# EAGLE design esp32 gps pcb (EAGLE 9.6.2)
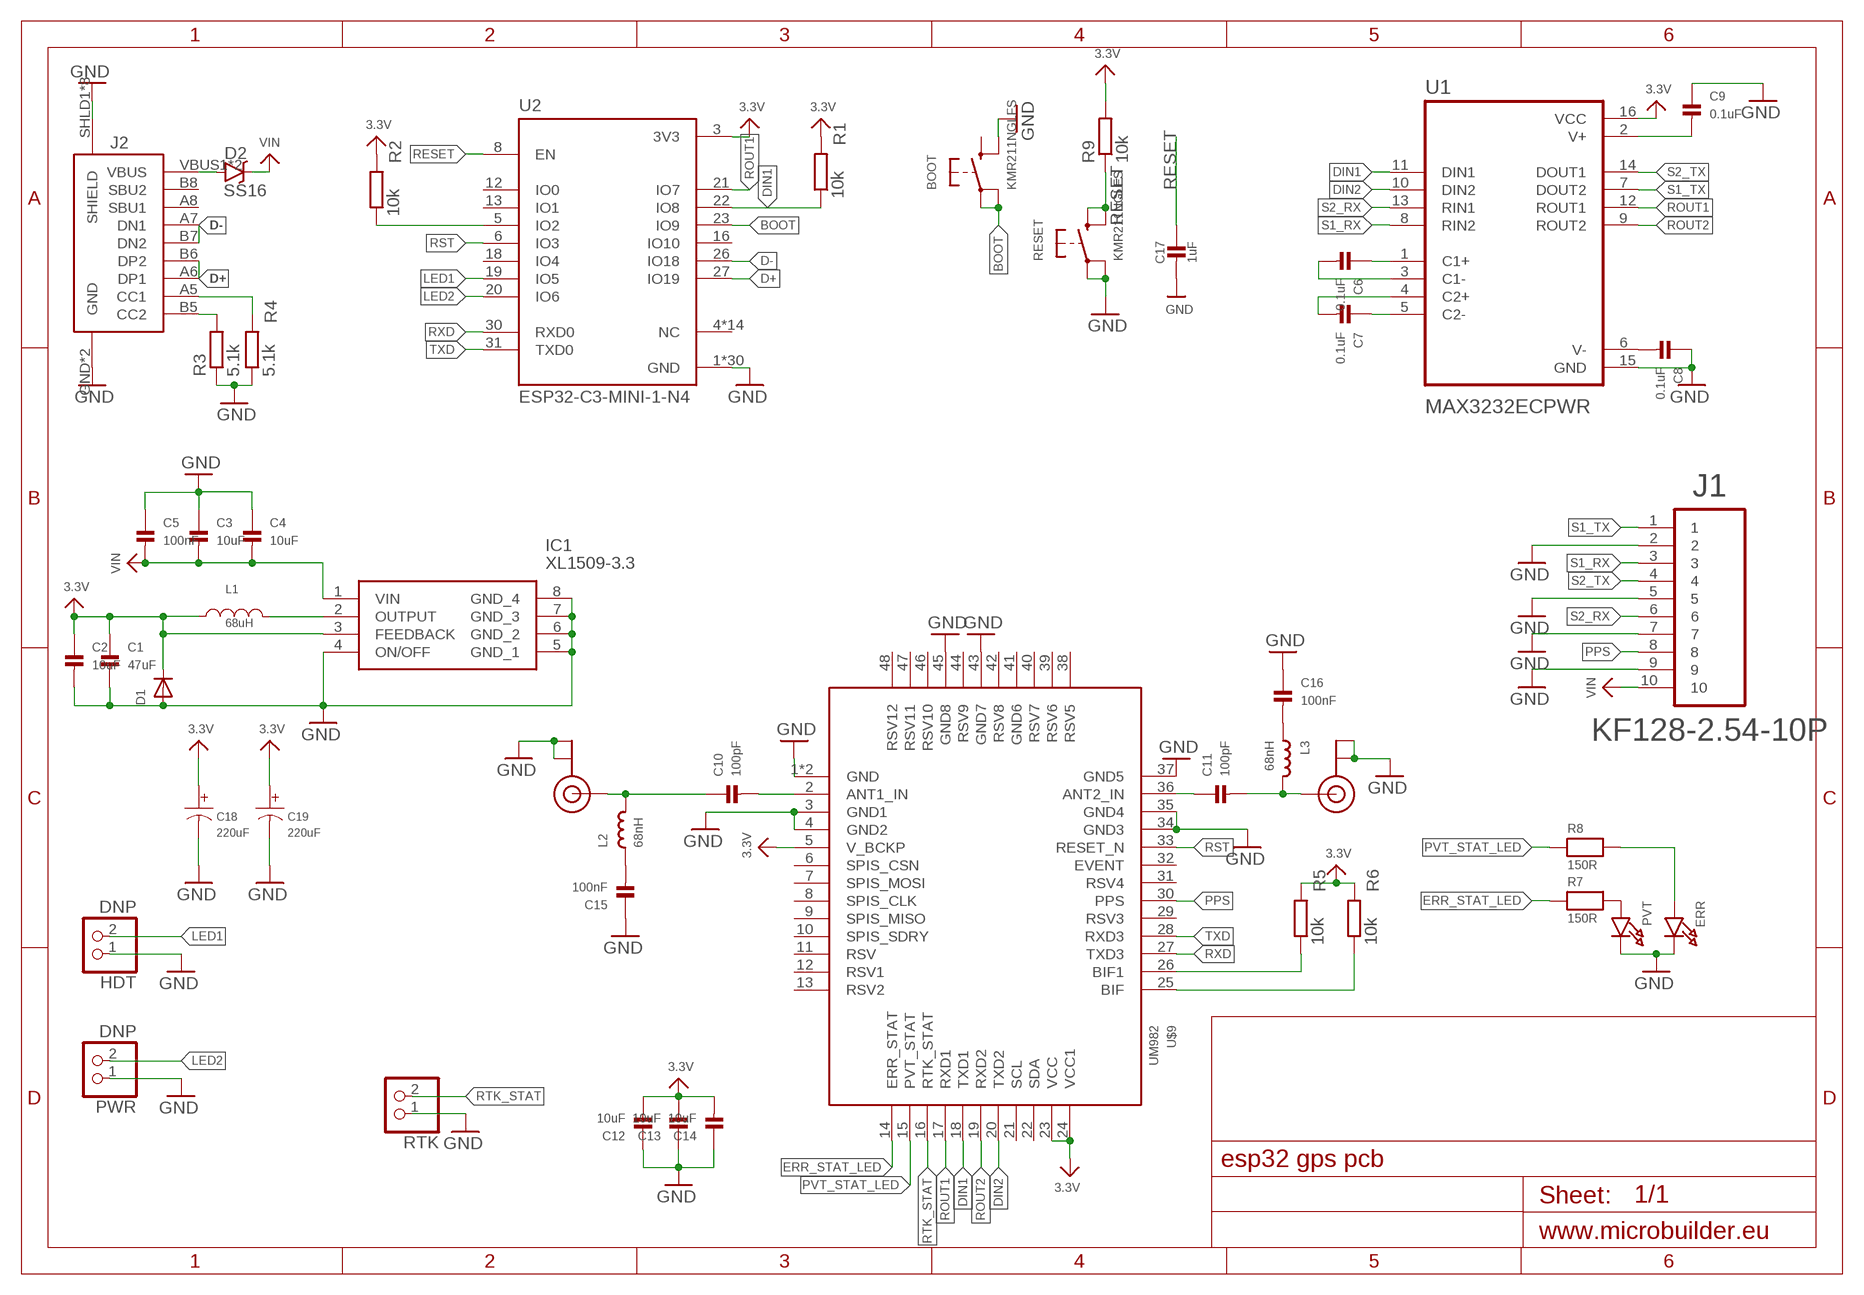
[diagram p0: schematic, sheet 1]

## Parts
BOOT  KMR211NGLFS  SWITCH_TACT_SMT4.6X2.8  [BTN_KMR2_4.6X2.8]
C1  47uF  CAP_CERAMIC_0805  [_0805]
C2  10uF  CAP_CERAMIC_0603  [_0603]
C3  10uF  CAP_CERAMIC_0603  [_0603]
C4  10uF  CAP_CERAMIC_0603  [_0603]
C5  100nF  CAP_CERAMIC_0603  [_0603]
C6  0.1uF  CAP_CERAMIC_0603  [_0603]
C7  0.1uF  CAP_CERAMIC_0603  [_0603]
C8  0.1uF  CAP_CERAMIC_0603  [_0603]
C9  0.1uF  CAP_CERAMIC_0603  [_0603]
C10  100pF  CAP_CERAMIC_0603  [_0603]
C11  100pF  CAP_CERAMIC_0603  [_0603]
C12  10uF  CAP_CERAMIC_0603  [_0603]
C13  10uF  CAP_CERAMIC_0603  [_0603]
C14  10uF  CAP_CERAMIC_0603  [_0603]
C15  100nF  CAP_CERAMIC_0603  [_0603]
C16  100nF  CAP_CERAMIC_0603  [_0603]
C17  1uF  CAP_CERAMIC_0603  [_0603]
C18  220uF  220UF220UF_CAP-SMD_BD6.3-L6.6-W6.6-FD  [CAP-SMD_BD6.3-L6.6-W6.6-FD]
C19  220uF  220UF220UF_CAP-SMD_BD6.3-L6.6-W6.6-FD  [CAP-SMD_BD6.3-L6.6-W6.6-FD]
D1  DIODESMA  [SMADIODE]
D2  SS16  DIODE-SCHOTTKY-B340A  [SMA-DIODE]
ERR  LED0603  [CHIPLED_0603]
HDT  DNP  HEADER-1X2ROUND  [1X02_ROUND]
IC1  XL1509-3.3  [SOIC127P600X175-8N]
J1  KF128-2.54-10P  [KF128-2.54-10P]
J2  TYP-C16PIN2MD  [USB-C-16P]
L1  68uH  PNLS6045_680  [IND-SMD_L6.0-W6.0]
L2  68nH  INDUCTOR_0603  [_0603]
L3  68nH  INDUCTOR_0603  [_0603]
PRI  KH-IPEX-K501-29  U.FL  [U.FL]
PVT  LED0603  [CHIPLED_0603]
PWR  DNP  HEADER-1X2ROUND  [1X02_ROUND]
R1  10k  R-EU_R0402  [R0402]
R2  10k  R-EU_R0402  [R0402]
R3  5.1k  R-EU_R0402  [R0402]
R4  5.1k  R-EU_R0402  [R0402]
R5  10k  R-EU_R0402  [R0402]
R6  10k  R-EU_R0402  [R0402]
R7  150R  RESISTOR_0603  [_0603]
R8  150R  RESISTOR_0603  [_0603]
R9  10k  R-EU_R0603  [R0603]
RESET  KMR211NGLFS  SWITCH_TACT_SMT4.6X2.8  [BTN_KMR2_4.6X2.8]
RTK  HEADER-1X2ROUND  [1X02_ROUND]
SEC  KH-IPEX-K501-29  U.FL  [U.FL]
U1  MAX3232ECPWR  [SOP65P640X120-16N]
U2  ESP32-C3-MINI-1-N4  [XCVR_ESP32-C3-MINI-1-N4]
U$9  UM982  [UM982]

## Nets
3.3V: C1.1 C2.1 C12.2 C13.2 C14.2 C18.1 C19.1 D1.C IC1.3(FEEDBACK) L1.1 R1.2 R2.2 R5.2 R6.2 R9.2 U1.16(VCC) U2.3(3V3) U$9.5(V_BCKP) U$9.23(VCC) U$9.24(VCC1)
BOOT: BOOT.A'(P1) BOOT.A(P) U2.23(IO9)
D+: J2.A6(DP1) J2.B6(DP2) U2.27(IO19)
D-: J2.A7(DN1) J2.B7(DN2) U2.26(IO18)
DIN1: R1.1 U1.11(DIN1) U2.22(IO8) U$9.18(TXD1)
DIN2: U1.10(DIN2) U$9.20(TXD2)
ERR_STAT_LED: R7.1 U$9.14(ERR_STAT)
GND: BOOT.B'(S1) C1.2 C2.2 C3.1 C4.1 C5.1 C8.1 C9.1 C12.1 C13.1 C14.1 C15.1 C16.1 C17.2 C18.2 C19.2 D1.A ERR.C HDT.1 IC1.4(ON/OFF) IC1.5(GND_1) IC1.6(GND_2) IC1.7(GND_3) IC1.8(GND_4) J1.2 J1.5 J1.7 J1.9 J2.GND J2.GND2(GND) J2.SHLD1(SHIELD) J2.SHLD2(SHIELD) J2.SHLD3(SHIELD) J2.SHLD4(SHIELD) J2.SHLD5(SHIELD) J2.SHLD6(SHIELD) J2.SHLD7(SHIELD) J2.SHLD8(SHIELD) PRI.1(GND) PRI.2(GND) PVT.C PWR.1 R3.1 R4.1 RESET.A'(P1) RESET.A(P) RTK.1 SEC.1(GND) SEC.2(GND) U1.15(GND) U2.1(GND) U2.2(GND) U2.11(GND) U2.14(GND) U2.36(GND) U2.37(GND) U2.38(GND) U2.39(GND) U2.40(GND) U2.41(GND) U2.42(GND) U2.43(GND) U2.44(GND) U2.45(GND) U2.46(GND) U2.47(GND) U2.48(GND) U2.49_1(GND) U2.49_2(GND) U2.49_3(GND) U2.49_4(GND) U2.49_5(GND) U2.49_6(GND) U2.49_7(GND) U2.49_8(GND) U2.49_9(GND) U2.50(GND) U2.51(GND) U2.52(GND) U2.53(GND) U$9.1(GND) U$9.3(GND1) U$9.4(GND2) U$9.34(GND3) U$9.35(GND4) U$9.37(GND5) U$9.43(GND7) U$9.45(GND8) U$9.P$1(GND)
LED1: HDT.2 U2.19(IO5)
LED2: PWR.2 U2.20(IO6)
N$1: C6.1 U1.1(C1+)
N$2: C8.2 U1.6(V-)
N$3: C10.1 L2.2 PRI.3(SIGNAL)
N$4: C6.2 U1.3(C1-)
N$5: C9.2 U1.2(V+)
N$6: C10.2 U$9.2(ANT1_IN)
N$7: C7.1 U1.5(C2-)
N$8: C7.2 U1.4(C2+)
N$9: C11.1 U$9.36(ANT2_IN)
N$10: R5.1 U$9.26(BIF1)
N$11: J2.B5(CC2) R3.2
N$12: J2.A5(CC1) R4.2
N$13: D2.A J2.VBUS1(VBUS) J2.VBUS2(VBUS)
N$14: IC1.2(OUTPUT) L1.2
N$15: R2.1 U2.5(IO2)
N$16: R6.1 U$9.25(BIF)
N$26: C11.2 L3.2 SEC.3(SIGNAL)
N$27: C15.2 L2.1
N$29: PVT.A R7.2
N$30: C16.2 L3.1
N$31: ERR.A R8.2
PPS: J1.8 U$9.30(PPS)
PVT_STAT_LED: R8.1 U$9.15(PVT_STAT)
RESET: C17.1 R9.1 RESET.B'(S1) RESET.B(S) U2.8(EN)
ROUT1: U1.12(ROUT1) U2.21(IO7) U$9.17(RXD1)
ROUT2: U1.9(ROUT2) U$9.19(RXD2)
RST: U2.6(IO3) U$9.33(RESET_N)
RTK_STAT: RTK.2 U$9.16(RTK_STAT)
RXD: U2.30(RXD0) U$9.27(TXD3)
S1_RX: J1.3 U1.8(RIN2)
S1_TX: J1.1 U1.7(DOUT2)
S2_RX: J1.6 U1.13(RIN1)
S2_TX: J1.4 U1.14(DOUT1)
TXD: U2.31(TXD0) U$9.28(RXD3)
VIN: C3.2 C4.2 C5.2 D2.C IC1.1(VIN) J1.10
Unconnected: BOOT.B(S) J2.A8(SBU1) J2.B8(SBU2) U2.4(NC) U2.7(NC) U2.9(NC) U2.10(NC) U2.12(IO0) U2.13(IO1) U2.15(NC) U2.16(IO10) U2.17(NC) U2.18(IO4) U2.24(NC) U2.25(NC) U2.28(NC) U2.29(NC) U2.32(NC) U2.33(NC) U2.34(NC) U2.35(NC) U$9.6(SPIS_CSN) U$9.7(SPIS_MOSI) U$9.8(SPIS_CLK) U$9.9(SPIS_MISO) U$9.10(SPIS_SDRY) U$9.11(RSV) U$9.12(RSV1) U$9.13(RSV2) U$9.21(SCL) U$9.22(SDA) U$9.29(RSV3) U$9.31(RSV4) U$9.32(EVENT) U$9.38(RSV5) U$9.39(RSV6) U$9.40(RSV7) U$9.41(GND6) U$9.42(RSV8) U$9.44(RSV9) U$9.46(RSV10) U$9.47(RSV11) U$9.48(RSV12)

## Library data of the parts
BOOT RESET = adafruit_electromech:SWITCH_TACT_SMT: SMT Tact Switches 6x6mm - Digikey: P12940SCT-ND KMR2 (4.6x2.8mm) - Digikey: 401-1426-1-ND EVQ-PQHB55 - Light Touch, 160GF (4.5x4.5mm) - Digikey: P8090SCT-ND KMT0 - KMT021 NGJ LHS (etc.) IP68/Waterproof - Digikey: CKN10289CT-ND
C1-C9 C11-C14 C17 = microbuilder:CAP_CERAMIC: Ceramic Capacitors 0402 - 0402 Surface Mount Capacitors 16pF 50V 5% [Digikey: 445-4899-2-ND] 18pF 50V 5% [Digikey: 490-1281-2-ND] 22pF 50V 5% [Digikey: 490-1283-2-ND] 68pF 50V 5% [Digikey: 490-1289-2-ND] 0.1uF 10V 10% [Digikey: 490-1318-2-ND] 1.0uF 6.3V 10% [Digikey: 490-1320-2-ND] 0603 - 0603 Surface Mount Capacitors 16 pF 50V 5% [Digikey: 445-5051-2-ND] 22 pF 50V [Digikey: PCC220ACVTR-ND] 33 pF 50V 5% [Digikey: 490-1415-1-ND] 56pF 50V 5% [Digikey: 490-1421-1-ND] 220pF 50V 5% [Digikey: 445-1285-1-ND] 680 pF 50V 2200 pF 50V 5% C0G [Digikey: 445-1297-1-ND] 5600 pF 100V 5% X7R [Digikey: 478-3711-1-ND] 0.1 µF 25V 10% [Digikey: PCC2277TR-ND] 0.22 µF 16V 10% X7R [Digikey: 445-1318-1-ND] 1.0 µF 25V 10% [Digikey: 445-5146-2-ND] 0603 - RF Specific 3pF 250V +/-0.1pF RF [Digikey: 712-1347-1-ND] 18 pF 250V 5% [Digikey: 478-3505-1-ND or 712-1322-1-ND] 56 pF 250V 5% C0G RF [Digikey: 490-4867-1-ND] 68 pF 250V RF [Digikey: 490-4868-1-ND] 0805 - 0805 Surface Mount Capacitors 220 pF 250V 2% RF Ceramic Capacitor [Digikey: 712-1398-1-ND] 1000 pF 50V 2% NP0 Ceramic Capacitor [Digikey: 478-3760-1-ND] 0.1 µF 25V 10% Ceramic Capacitor [Digikey: PCC1828TR-ND] 1.0 µF 16V 10% Ceramic Capacitor[Digikey: 490-1691-2-ND] 10.0 µF 10V 10% Ceramic Capacitor[Digikey: 709-1228-1-ND] 10.0 uF 16V 10% Ceramic Capacitor [Digikey: 478-5165-2-ND] 47 uF 6.3V 20% Ceramic Capacitor [Digikey: 587-1779-1-ND or 399-5506-1-ND] 1206 - 1206 Surface Mount Capacitors 47uF 10V 20% Ceramic Capacitor [Digikey: 490-5528-1-ND or 399-5508-1-ND or 445-6010-1-ND] 100uF 6.3V -20%, +80% Y5V Ceramic Capacitor (Digikey: 490-4512-1-ND, Mouser: 81-GRM31CF50J107ZE1L)
C10 C15 C16 = microbuilder:CAP_CERAMIC: Ceramic Capacitors 0402 - 0402 Surface Mount Capacitors 16pF 50V 5% [Digikey: 445-4899-2-ND] 18pF 50V 5% [Digikey: 490-1281-2-ND] 22pF 50V 5% [Digikey: 490-1283-2-ND] 68pF 50V 5% [Digikey: 490-1289-2-ND] 0.1uF 10V 10% [Digikey: 490-1318-2-ND] 1.0uF 6.3V 10% [Digikey: 490-1320-2-ND] 0603 - 0603 Surface Mount Capacitors 16 pF 50V 5% [Digikey: 445-5051-2-ND] 22 pF 50V [Digikey: PCC220ACVTR-ND] 33 pF 50V 5% [Digikey: 490-1415-1-ND] 56pF 50V 5% [Digikey: 490-1421-1-ND] 220pF 50V 5% [Digikey: 445-1285-1-ND] 680 pF 50V 2200 pF 50V 5% C0G [Digikey: 445-1297-1-ND] 5600 pF 100V 5% X7R [Digikey: 478-3711-1-ND] 0.1 µF 25V 10% [Digikey: PCC2277TR-ND] 0.22 µF 16V 10% X7R [Digikey: 445-1318-1-ND] 1.0 µF 25V 10% [Digikey: 445-5146-2-ND] 0603 - RF Specific 3pF 250V +/-0.1pF RF [Digikey: 712-1347-1-ND] 18 pF 250V 5% [Digikey: 478-3505-1-ND or 712-1322-1-ND] 56 pF 250V 5% C0G RF [Digikey: 490-4867-1-ND] 68 pF 250V RF [Digikey: 490-4868-1-ND] 0805 - 0805 Surface Mount Capacitors 220 pF 250V 2% RF Ceramic Capacitor [Digikey: 712-1398-1-ND] 1000 pF 50V 2% NP0 Ceramic Capacitor [Digikey: 478-3760-1-ND] 0.1 µF 25V 10% Ceramic Capacitor [Digikey: PCC1828TR-ND] 1.0 µF 16V 10% Ceramic Capacitor[Digikey: 490-1691-2-ND] 10.0 µF 10V 10% Ceramic Capacitor[Digikey: 709-1228-1-ND] 10.0 uF 16V 10% Ceramic Capacitor [Digikey: 478-5165-2-ND] 47 uF 6.3V 20% Ceramic Capacitor [Digikey: 587-1779-1-ND or 399-5506-1-ND] 1206 - 1206 Surface Mount Capacitors 47uF 10V 20% Ceramic Capacitor [Digikey: 490-5528-1-ND or 399-5508-1-ND or 445-6010-1-ND] 100uF 6.3V -20%, +80% Y5V Ceramic Capacitor (Digikey: 490-4512-1-ND, Mouser: 81-GRM31CF50J107ZE1L); SPICEPREFIX: C
C18 C19 = RVT1A221M0605:220UF: No description set; BOM_JLCPCB_PART_CLASS: Extended Part; BOM_MANUFACTURER: ROQANG(??); BOM_MANUFACTURER_PART: RVT1A221M0605; BOM_SUPPLIER: LCSC; BOM_SUPPLIER_PART: C72494; NAMEALIAS: Capacitance; SPICEPRE: C; SPICESYMBOLNAME: RVT1A221M0605-C72494
D1 = microbuilder:DIODE: Diode SMA Model Volts Amps Type Vf Vr Digikey # Notes SSA34-E3 40V 3A Schottky 480mV @ 3A 200uA @ 40V SSA34-E3/61TGITR-ND CDBA120-G 20V 1A Schottky 500mV @ 1A 500uA @ 20V 641-1014-6-ND REEL MBRA210 10V 2A Schottky 350mV @ 2A 700uA @ 10V MBRA210LT3 SOD-123 Model Volts Amps Type Vf Vr Order # Notes BAT54T1G 30V 200mA Schottky 800mV @ 200mA 2uA @ 25V BAT54T1GOSTR-ND B0530W 30V 500mA Schottky 430mV @ 500mA 130uA @ 30V B0530W-FDICT-ND REEL MBR120 1A 20V Schottky 340mV @ 1A MBR120VLSFT1GOSCT-ND SOD-323 Model Volts Amps Type Vf Vr Order # Notes PMEG2005EJ 20V 500mA Schottky 355mV @ 500mA 568-4110-1-ND ZLLS410 10V 570mA Schottky 380mV @ 570mA ZLLS410CT-ND 1N4148WS 75V 150mA Silicon/Simple 1V 1N4148WSFSCT-ND REEL SOD-523 Model Volts Amps Type Vf Vr Order # Notes BAT54XV2 30V 200mA Schottky 0.8V @ 100mA BAT54XV2CT-ND TB751S 30V 30mA Schottky RB751S-40TE61CT-ND SOT23-R/W (R = Solder Paste/Reflow Ovens, W = Hand-Soldering) Model Volts Amps Type Vf Vr Order # Notes BAT54FILM 40V 300mA Schottky 497-7162-1-ND
D2 = SparkFun-DiscreteSemi:DIODE-SCHOTTKY: Schottky diodes in SFE's production catalog BAT20J 1A 23V 0.62Vf RB751 120mA 40V 0.37Vf PMEG4005EJ 0.5A 40V 0.42Vf MBRA140 1A 40V 0.5Vf B340A 3A 40V SMA; PROD_ID: DIO-09886; VALUE: B340A
ERR PVT = microbuilder:LED: LED 0603 - 0603 Surface Mount Package 2mA: Green LED - Low Power (3.9mcd, 2ma, 1.7Vf) - Digikey: 475-2709-2-ND Orange LED - Low Power (9.8mcd, 2ma, 1.8Vf) - Digikey: 475-1194-2-ND Red LED - Low Power (5mcd, 2ma, 1.8Vf) - Digikey: 475-1195-2-ND Yellow LED - Low Power (7mcd, 2ma, 1.8Vf) - Digikey: 475-1196-2-ND 5mA: Blue LED - Low Power (17mcd, 5ma, 2.9Vf) - Digikey: LNJ937W8CRACT-ND 0805 - 0805 Surface Mount Package 2mA: Red LED (8.8mcd, 2mA, 1.8Vf, Clear) - Low Power [Digikey: 475-2510-1-ND] Green LED (5mcd, 2mA, 1.8Vf, Clear) - Low Power [Digikey: 475-2730-1-ND] Yellow LED (11.3mcd, 2mA, 1.8Vf, Clear) - Low Power [Digikey: 475-2555-1-ND] 20mA: Red LED (104mcd, 20mA, Diffused) - LS R976 [Digikey: 475-1278-6-ND] Red LED (12mcd, 20mA, 2.0Vf, Clear) - APT2012EC [Digikey: 754-1128-1-ND] Green LED (15mcd, 20mA, 2.2Vf, Clear) - APT2012GC [Digikey: 754-1131-1-ND] Orange LED (160mcd, 20mA, 2.1Vf, Clear) - APT2012SECK [Digikey: 754-1130-1-ND] 1206 - 1206 Surface Mount Package Green LED (26mcd, 20mA, Diffused) - LG N971 [Digikey: 475-1407-6-ND] Red LED (15mcd, 20mA, Diffused) - LH N974 [Digikey: 475-1416-6-ND]
HDT PWR RTK = microbuilder:HEADER-1X2: PIN HEADER
IC1 = XL1509-3.3:XL1509-3.3: gh Source: Datasheet <https://datasheet.lcsc.com/lcsc/1809050422_XLSEMI-XL1509-5-0E1_C61063.pdf>; DESCRIPTION: gh; HEIGHT: 1.75mm; MANUFACTURER_NAME: 1-Avel; MANUFACTURER_PART_NUMBER: XL1509-3.3
J1 = KF128-2.54-10P:KF128-2.54-10P: TERM BLOCK 10POS SIDE ENT 2.54MM; COMMENT: 1-282834-0; DESCRIPTION: Conn Eurostyle Block 10 POS 2.54mm Solder ST Thru-Hole 10A/Contact Box; DIGI-KEY_PART_NUMBER: A98074-ND; EU_ROHS_COMPLIANCE: Compliant with Exemptions; MF: TE Connectivity; MP: 1-282834-0; PACKAGE: None; PURCHASE-URL: https://pricing.snapeda.com/search/part/1-282834-0/?ref=eda
J2 = TYPE-C 16PIN 2MD:TYP-C16PIN2MD: Check availability <https://pricing.snapeda.com/parts/TYPE-C-31-M-12/HRO%20Electronics%20Co.%2C%20Ltd./view-part?ref=eda>
L1 = PNLS6045:PNLS6045_680
L2 L3 = microbuilder:INDUCTOR: Inductors 0603: 10nH Ceramic Inductor - microwire antenna/RF (Digikey: 712-1434-2-ND) 0805: 560nH Ceramic Inductor - RF (Digikey: 553-1047-1-ND) 270nH Ceramic Inductor - Q = 40@250MHz, +-5%, 1 Ohm DC Resistance (Digikey: 535-10506-2-ND) 1007 (2518 Metric) SMT: 10µH 10% 250mOhm 820mA 1007 Inductor (Digikey: 587-2189-1-ND) 22µH 10% 500mOhm 580mA 1007 Inductor (Digikey: 587-2190-1-ND) 47µH 10% 950mOhm 420mA 1007 Inductor (Digikey: 587-2191-1-ND) 47µH 5% 100mOhm 1A 1008 Inductor (Digikey: 732-1816-1-ND) 5.0x5.0mm (Taiyo Yuden NR5040 Series) 6.8µH 20% 2.3A 64mOhm Inductor (Digikey: 587-2374-2-ND) 5.0x5.0mm (TDK VLC5045 Series) 4.7µH 20% 3.3A 34mOhm Inductor (Digikey: 445-6526-1-ND) 6.8µH 20% 2.7A 46mOhm Inductor (Digikey: 445-6527-1-ND) 6.0x6.0mm (TDK VLC6045 Series) 4.7µH 20% 3.8A 27mOhm Inductor (Digikey: 445-6538-2-ND) 6.8µH 20% 3A 41mOhm Inductor (Digikey: 445-6540-1-ND) 6.2µH 30% 2.2A 45mOhm Inductor (Digikey: SRR5028-6R2YCT-ND) - Not TDK VLC6045 but footprint should match 6.0x6.0mm (TDK SLF6045 Series) 6.8uH 30% 2A 33mOhm Inductor (Digikey: 445-4572-1-ND, Mouser: 810-SLF645T6R8N2R0PF)
PRI SEC = microbuilder:U.FL: U.FL Antenna Connector
R1-R6 R9 = rcl:R-EU_: RESISTOR, European symbol; SPICEPREFIX: R
R7 R8 = microbuilder:RESISTOR: Resistors 0402 - 0402 Surface Mount Package 22 Ohm 1% 1/16W [Digikey: 311-22.0LRTR-ND] 33 Ohm 5% 1/16W 1.0K 5% 1/16W 1.5K 5% 1/16W 2.0K 1% 1/16W 10.0K 1% 1/16W [Digikey: 311-10.0KLRTR-ND] 10.0K 5% 1/16W [Digikey: RMCF0402JT10K0TR-ND] 12.1K 1% 1/16W [Digikey: 311-22.0LRTR-ND] 100.0K 5% 1/16W 0603 - 0603 Surface Mount Package 0 Ohm 1/10 Watt 1% Resistor 15 Ohm 1/10 Watt 1% Resistor 33 Ohm 1/10 Watt 1% Resistor 49.9 Ohm 1/10 Watt 1% Resistor 100 Ohm 1/10 Watt 1% Resistor 150 Ohm 1/10 Watt 1% Resistor 240 Ohm 1/10 Watt 1% Resistor 390 Ohm 1/10 Watt 1% Resistor 560 Ohm 1/10 Watt 1% Resistor 680 Ohm 1/10 Watt 1% Resistor 750 Ohm 1/10 Watt 1% Resistor 1.0K Ohm 1/10 Watt 1% Resistor 1.5K Ohm 1/10 Watt 1% Resistor 2.0K Ohm 1/10 Watt 1% Resistor 2.2K Ohm 1/10 Watt 1% Resistor 3.3K Ohm 1/10 Watt 1% Resistor 4.7K Ohm 1/10 Watt 1% Resistor 10.0K Ohm 1/10 Watt 1% Resistor 12.0K Ohm 1/10 Watt 1% Resistor 12.1K Ohm 1/10 Watt 1% Resistor 20.0K Ohm 1/10 Watt 1% Resistor 33.0K Ohm 1/10 Watt 1% Resistor 100.0K Ohm 1/10 Watt 1% Resistor 0805 - 0805 Surface Mount Package 0 Ohm 1/8 Watt 1% Resistor 33 Ohm 1/8 Watt 1% Resistor 100 Ohm 1/8 Watt 1% Resistor 150 Ohm 1/8 Watt 1% Resistor 200 Ohm 1/8 Watt 1% Resistor 240 Ohm 1/8 Watt 1% Resistor 330 Ohm 1/8 Watt 1% Resistor 390 Ohm 1/8 Watt 1% Resistor 470 Ohm 1/8 Watt 1% Resistor 1.0K Ohm 1/8 Watt 1% Resistor 1.5K Ohm 1/8 Watt 1% Resistor 2.0K Ohm 1/8 Watt 1% Resistor 4.7K Ohm 1/8 Watt 1% Resistor 5.1K Ohm 1/8 Watt 1% Resistor 5.6K Ohm 1/8 Watt 1% Resistor 10.0K Ohm 1/8 Watt 1% Resistor 22.0K Ohm 1/8 Watt 1% Resistor 33.0K Ohm 1/8 Watt 1% Resistor 100K Ohm 1/8 Watt 1% Resistor 1206 - 1206 Surface Mount Package 2012 - 2010 Surface Mount Package 0.11 Ohm 1/2 Watt 1% Resistor - Digikey: RHM.11UCT-ND
U1 = MAX3232ECPWR:MAX3232ECPWR
U2 = ESP32-C3-MINI-1-N4:ESP32-C3-MINI-1-N4: Check availability <https://pricing.snapeda.com/parts/ESP32-C3-MINI-1-N4/Espressif%20Systems/view-part?ref=eda>; AVAILABILITY: In Stock; DESCRIPTION: Bluetooth, WiFi 802.11b/g/n, Bluetooth v5.0 Transceiver Module 2.412GHz ~ 2.484GHz PCB Trace Surface Mount; MF: Espressif Systems; MP: ESP32-C3-MINI-1-N4; PACKAGE: SMD-53 Espressif Systems; PRICE: None; PURCHASE-URL: https://pricing.snapeda.com/search/part/ESP32-C3-MINI-1-N4/?ref=eda
U$9 = um928:UM982

## Board
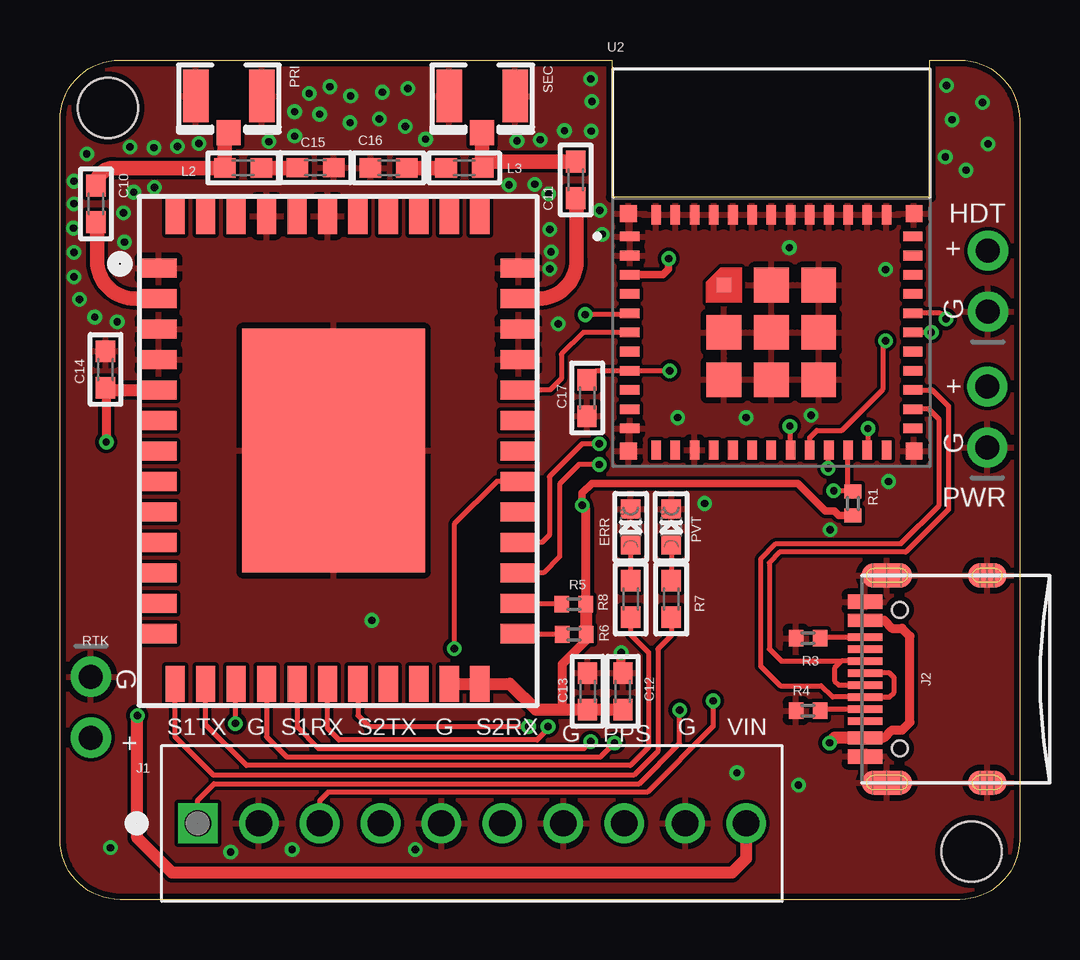
[diagram p1: board, top side]
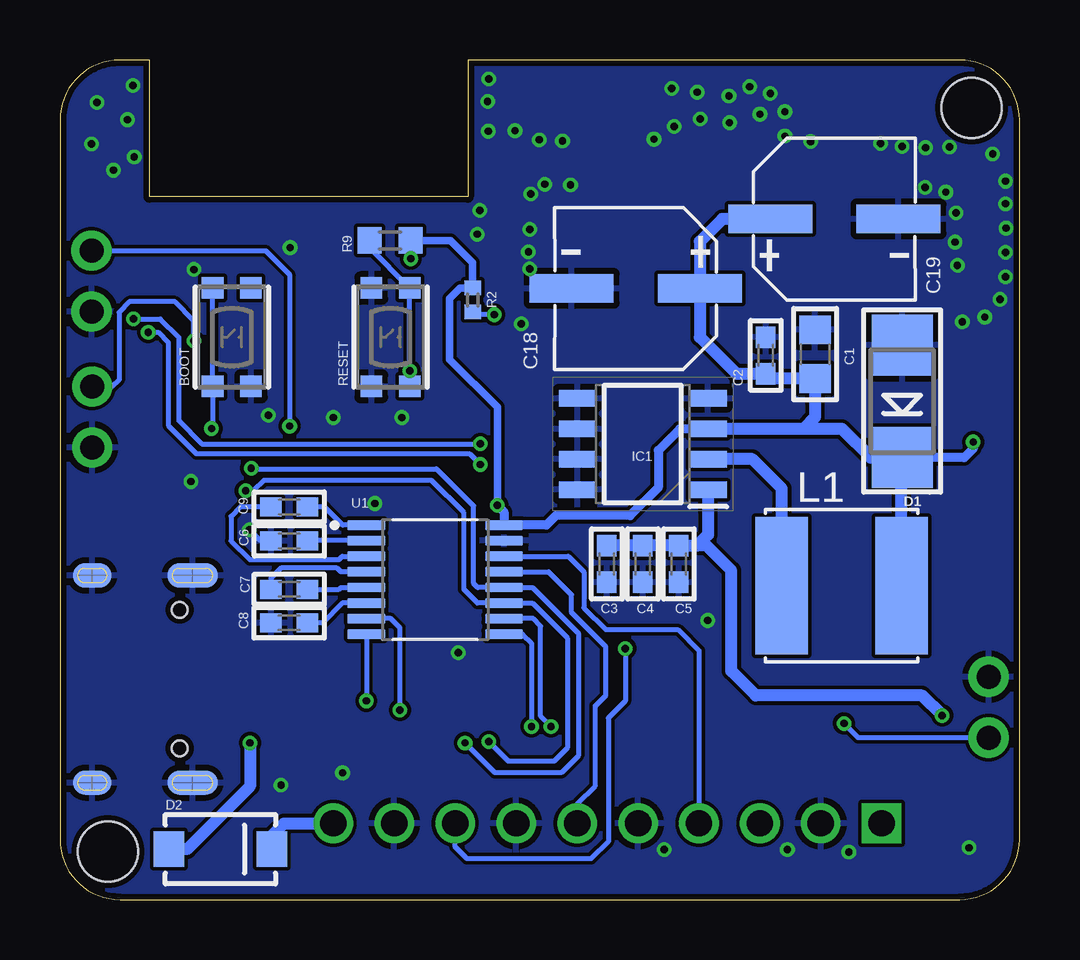
[diagram p2: board, bottom side, seen from below]

Size 40 x 35 mm. Coordinates in mm from the lower left corner, seen from the top.
Outline: 40,32.5 40,2.5 arc-90 37.5,0 2.5,0 arc-90 0,2.5 0,32.5 arc-90 2.5,35 23,35 23,29.3 36.27,29.3 36.27,35 37.5,35 arc-90 40,32.5
Copper layers (1*16): Top 0.035mm / dielectric 1.5mm / Bottom 0.035mm
Design rules "default *": minimum track width 6mil, minimum drill 0.3mm, track to track 6mil, track to pad 6mil, pad to pad 6mil, via to via 6mil, smd to smd 0mil, copper to edge 10mil, drill to drill 6mil, minimum pad ring 10mil, minimum via ring 6mil, stop-mask expansion 0mil, vias tented up to drill 15mil, thermal gap 10mil
Holes 2.5 mm at 2,33 38,2

### Footprints (pad centres in the part's own frame; a part is rotated, then mirrored left to right if it is on the bottom)
BTN_KMR2_4.6X2.8 = smd 0.9 x 0.9: A 2.05,0.8; A' -2.05,0.8; B 2.05,-0.8; B' -2.05,-0.8
_0805 = smd 1.2 x 1.3: 1 -1.016,0; 2 1.016,0
_0603 = smd 0.9 x 0.8: 1 -0.762,0; 2 0.762,0
CAP-SMD_BD6.3-L6.6-W6.6-FD = smd 3.5 x 1.2: 1 -2.67,0; 2 2.67,0
SMADIODE = smd 2.54 x 2.54: A 2.349,0; C -2.349,0
SMA-DIODE = smd 1.27 x 1.47: A -2.15,0; C 2.15,0
CHIPLED_0603 = smd 0.8 x 0.8: A 0,-0.75; C 0,0.75
1X02_ROUND = drill 1 pad 1.676: 1 -1.27,0; 2 1.27,0
SOIC127P600X175-8N = smd 1.55 x 0.7: 1 -2.725,1.905; 2 -2.725,0.635; 3 -2.725,-0.635; 4 -2.725,-1.905; 5 2.725,-1.905; 6 2.725,-0.635; 7 2.725,0.635; 8 2.725,1.905
KF128-2.54-10P = drill 1.1 square: 1 0,0 | drill 1.1: 2 2.54,0; 3 5.08,0; 4 7.62,0; 5 10.16,0; 6 12.7,0; 7 15.24,0; 8 17.78,0; 9 20.32,0; 10 22.86,0
USB-C-16P = smd 0.3 x 1.45: A5 -1.25,0; A6 -0.25,0; A7 0.25,0; A8 1.25,0; B5 1.75,0; B6 0.75,0; B7 -0.75,0; B8 -1.75,0 | smd 0.6 x 1.45: GND -3.225,0; GND2 3.225,0 | smd 1 x 2.1: SHLD1 -4.32,-0.915; SHLD2 4.32,-0.915 | smd 1 x 2.1 bottom: SHLD3 -4.32,-0.915; SHLD4 4.32,-0.915 | smd 1 x 1.6: SHLD5 -4.32,-5.095; SHLD8 4.32,-5.095 | smd 1 x 1.6 bottom: SHLD6 -4.32,-5.095; SHLD7 4.32,-5.095 | smd 0.55 x 1.45: VBUS1 -2.45,0; VBUS2 2.45,0 | hole 0.65: -2.89,-1.445; 2.89,-1.445
IND-SMD_L6.0-W6.0 = smd 2.2 x 5.72: 1 -2.5,0; 2 2.5,0
U.FL = smd 2.2 x 1.05: 1 0,1.375; 2 0,-1.375 | smd 1.05 x 1: 3 1.525,0
R0402 = smd 0.6 x 0.7: 1 -0.5,0; 2 0.5,0
R0603 = smd 1 x 1.1: 1 -0.85,0; 2 0.85,0
SOP65P640X120-16N = smd 1.57 x 0.41: 1 -2.87,2.275; 2 -2.87,1.625; 3 -2.87,0.975; 4 -2.87,0.325; 5 -2.87,-0.325; 6 -2.87,-0.975; 7 -2.87,-1.625; 8 -2.87,-2.275; 9 2.87,-2.275; 10 2.87,-1.625; 11 2.87,-0.975; 12 2.87,-0.325; 13 2.87,0.325; 14 2.87,0.975; 15 2.87,1.625; 16 2.87,2.275
XCVR_ESP32-C3-MINI-1-N4 = smd 0.8 x 0.4: 1 -5.9,1.3; 2 -5.9,0.5; 3 -5.9,-0.3; 4 -5.9,-1.1; 5 -5.9,-1.9; 6 -5.9,-2.7; 7 -5.9,-3.5; 8 -5.9,-4.3; 9 -5.9,-5.1; 10 -5.9,-5.9; 11 -5.9,-6.7; 25 5.9,-6.7; 26 5.9,-5.9; 27 5.9,-5.1; 28 5.9,-4.3; 29 5.9,-3.5; 30 5.9,-2.7; 31 5.9,-1.9; 32 5.9,-1.1; 33 5.9,-0.3; 34 5.9,0.5; 35 5.9,1.3 | smd 0.4 x 0.8: 12 -4.8,-7.6; 13 -4,-7.6; 14 -3.2,-7.6; 15 -2.4,-7.6; 16 -1.6,-7.6; 17 -0.8,-7.6; 18 0,-7.6; 19 0.8,-7.6; 20 1.6,-7.6; 21 2.4,-7.6; 22 3.2,-7.6; 23 4,-7.6; 24 4.8,-7.6; 36 4.8,2.2; 37 4,2.2; 38 3.2,2.2; 39 2.4,2.2; 40 1.6,2.2; 41 0.8,2.2; 42 0,2.2; 43 -0.8,2.2; 44 -1.6,2.2; 45 -2.4,2.2; 46 -3.2,2.2; 47 -4,2.2; 48 -4.8,2.2 | smd 0.6 x 0.6: 49_1 -1.975,-0.725 | smd 1.45 x 1.45: 49_2 0,-0.725; 49_3 1.975,-0.725; 49_4 1.975,-2.7; 49_5 1.975,-4.675; 49_6 0,-4.675; 49_7 -1.975,-4.675; 49_8 -1.975,-2.7; 49_9 0,-2.7 | smd 0.7 x 0.7: 50 5.95,2.25; 51 5.95,-7.65; 52 -5.95,-7.65; 53 -5.95,2.25
UM982 = smd 0.8 x 1.5: 1 2.18,-13.39; 2 3.45,-13.39; 3 4.72,-13.39; 4 5.99,-13.39; 5 7.26,-13.39; 6 8.53,-13.39; 7 9.8,-13.39; 8 11.07,-13.39; 9 12.34,-13.39; 10 13.61,-13.39; 11 14.88,-13.39; 12 16.15,-13.39; 13 17.42,-13.39; 25 17.42,1.61; 26 16.15,1.61; 27 14.88,1.61; 28 13.61,1.61; 29 12.34,1.61; 30 11.07,1.61; 31 9.8,1.61; 32 8.53,1.61; 33 7.26,1.61; 34 5.99,1.61; 35 4.72,1.61; 36 3.45,1.61; 37 2.18,1.61 | smd 1.5 x 0.8: 14 19.5,-12.7; 15 19.5,-11.43; 16 19.5,-10.16; 17 19.5,-8.89; 18 19.5,-7.62; 19 19.5,-6.35; 20 19.5,-5.08; 21 19.5,-3.81; 22 19.5,-2.54; 23 19.5,-1.27; 24 19.5,0; 38 0,0; 39 0,-1.27; 40 0,-2.54; 41 0,-3.81; 42 0,-5.08; 43 0,-6.35; 44 0,-7.62; 45 0,-8.89; 46 0,-10.16; 47 0,-11.43; 48 0,-12.7 | smd 10.16 x 7.62: P$1 9.779,-6.096

### Placement (x,y rotation side)
BOOT  32.83,23.45 90 bottom
C1  8.52,22.73 90 bottom
C2  10.58,22.68 90 bottom
C3  17.21,13.99 90 bottom
C4  15.71,13.99 90 bottom
C5  14.21,13.99 90 bottom
C6  30.44,16.36 180 bottom
C7  30.44,12.93 180 bottom
C8  30.45,11.54 0 bottom
C9  30.44,14.95 0 bottom
C10  1.5,29 270 top
C11  21.5,30 90 top
C12  23.46,8.68 270 top
C13  21.99,8.68 270 top
C14  1.9,22.1 270 top
C15  10.65,30.51 180 top
C16  13.7,30.5 0 top
C17  21.97,20.91 270 top
C18  16,25.48 180 bottom
C19  7.72,28.37 0 bottom
D1  4.89,20.77 90 bottom
D2  33.31,2.1 0 bottom
ERR  23.79,15.53 0 top
HDT  38.68,25.78 90 top
IC1  15.71,18.99 180 bottom
J1  5.74,3.18 0 top
J2  33.56,9.19 90 top
L1  7.42,13.08 180 bottom
L2  7.63,30.5 180 top
L3  16.86,30.5 0 top
PRI  7.04,33.5 270 top
PVT  25.48,15.53 0 top
PWR  38.66,20.12 90 top
R1  33.05,16.51 270 top
R2  22.79,24.99 90 bottom
R3  31.18,10.89 0 top
R4  31.18,7.87 0 top
R5  21.42,12.32 0 top
R6  21.43,11.05 0 top
R7  25.48,12.53 90 top
R8  23.79,12.53 90 top
R9  26.24,27.47 0 bottom
RESET  26.22,23.45 90 bottom
RTK  1.29,8.02 270 top
SEC  17.6,33.5 270 top
U1  24.36,13.34 0 bottom
U2  29.65,26.34 0 top
U$9  17.5,28.5 270 top

### Tracks (layer width: path | path; a pad name or v marks a point on that pad's centre or on a via)
3.3V  (via drill 0.3)
  Top 0.305: R1.2 32.48,16.01 32.28,16.2 31.9,16.2 30.76,17.35 22.17,17.35 21.77,16.94 v21.77,16.43 | U2.3 25.13,26.04 25.38,26.29 v25.38,26.72
  Top 0.381: R5.2 21.92,16.28 v21.77,16.43 | R6.2 21.93,10.81 20.93,9.8 20.93,7.92 | C14.2 1.93,21.3 v1.93,19.07
  Top 0.508: U$9.23 U$9.24 18.75,9 19.83,7.92 20.05,7.92 20.64,7.92 20.65,7.92 20.93,7.92 C13.2 C12.2 | R5.2 21.93,12.31 R6.2 | U$9.5 1.99,21.24 C14.2
  Bottom 0.305: v21.77,16.43 21.77,20.52 23.76,22.52 23.76,25.06 23.32,25.49 R2.2 22.8,26.55 23.71,27.47 R9.2 25.38,27.45 v25.38,26.72
  Bottom 0.381: v21.77,16.43 21.49,16.16 U1.16 19.72,15.61 19.33,16 16.23,16 15.06,17.17 15.06,18.72 14.16,19.62 IC1.3 | v1.93,19.07 1.93,18.8 2.31,18.42 D1.C
  Bottom 0.508: D1.C 5.63,19.16 | C1.1 10.38,21.72 C2.1 11.81,21.92 13.33,23.44 C18.1 13.33,27.43 12.39,28.37 C19.1 | C1.1 8.64,21.6 | C1.1 8.79,21.45 | 25.26,27.47 R9.2 | L1.1 4.92,18.4 D1.C | D1.C 6.2,18.42 7.41,19.62 9.02,19.62 | 9.02,19.62 IC1.3 | C1.1 8.52,20.12 9.02,19.62
BOOT  (via drill 0.3)
  Top 0.203: v33.68,19.63 33.68,18.77 U2.23
  Bottom 0.203: BOOT.A BOOT.A' 33.63,19.68 v33.68,19.63
D+
  Top 0.203: J2.B6 32.57,9.94 | 32.57,9.94 32.28,9.65 32.28,9.12 32.46,8.94 J2.A6 | U2.27 36.36,21.24 37.03,20.57 37.03,16.26 35.26,14.48 30,14.48 29.57,14.05 29.57,10.44 30.07,9.94 32.57,9.94
D-
  Top 0.203: J2.A7 34.58,9.44 34.77,9.25 34.77,8.64 34.58,8.44 J2.B7 32.2,8.44 31.73,8.91 30.02,8.91 29.21,9.73 29.21,14.19 29.85,14.84 35.05,14.84 36.65,16.43 36.65,20.02 36.22,20.44 U2.26
DIN1  (via drill 0.3)
  Top 0.203: R1.1 32.98,17.08 | 32.98,17.08 32.85,17.21 U2.22 | v32.26,17.04 32.94,17.04 32.98,17.08 | U$9.18 9.88,7.19 10.77,6.3 21.84,6.3 v22.12,6.58
  Bottom 0.203: v32.26,17.04 31.93,17.04 31.5,17.48 24.51,17.48 23.16,16.13 23.16,12.93 22.6,12.36 U1.11 20.31,12.36 18.85,10.9 18.85,6.33 19.41,5.77 21.31,5.77 v22.12,6.58
DIN2  (via drill 0.3)
  Top 0.203: U$9.20 12.42,7.67 12.88,7.21 v19.53,7.21
  Bottom 0.203: v19.53,7.21 19.96,7.64 19.96,11.4 20.27,11.71 U1.10
ERR_STAT_LED
  Top 0.203: R7.1 25.48,11 24.92,10.44 24.92,6.17 23.93,5.18 6.4,5.18 4.8,6.78 U$9.14
GND  (via drill 0.3)
  Top 0.381: C12.1 23.39,9.51 v23.39,10.29
  Bottom 0.203: C9.1 31.24,14.99 31.67,14.99 v32.11,15.42
  other vias: 2.92,31.37 3.91,31.34 4.9,31.39 5.79,31.52 1.12,31.09 0.58,29.95 0.58,29.01 0.56,27.99 0.58,26.97 0.58,25.96 0.81,25.02 1.45,24.28 2.39,24.08 2.59,26.44 2.69,27.41 2.64,28.63 3.07,29.49 3.94,29.69 8.71,31.6 9.78,31.83 9.78,32.84 10.39,33.6 12.12,33.5 13.44,33.66 14.5,33.81 14.4,32.23 12.09,32.38 10.82,32.74 11.25,33.88 13.31,32.54 15.24,31.7 19.05,31.62 20.02,31.67 21.03,32.05 22.15,32.03 22.5,28.73 22.61,27.74 20.42,26.29 20.47,27 20.42,27.94 20.37,29.41 19.79,29.82 18.72,29.79 20.78,24 22.12,34.21 22.17,33.27 36.96,33.93 37.19,32.51 36.91,30.96 38.68,31.5 38.46,33.22 37.77,30.4 25.76,20.09 34.42,26.26 30.4,27.18 28.6,20.09 31.32,20.19 34.54,17.42 26.87,16.51 13,11.63 7.11,1.98 9.68,2.08 14.81,2.08 28.22,5.28 30.78,4.78 2.11,2.16
  pour Top: 0,35 23,35 23,29 36,29 36,35 40,35 40,0 0,0
  pour Bottom: 0,35 23,35 23,29 36,29 36,35 40,35 40,2.04 40,0 0,0
LED1  (via drill 0.3)
  Top 0.203: v30.43,19.74 30.43,18.77 U2.19
  Bottom 0.203: HDT.2 31.42,27.05 30.43,26.06 v30.43,19.74
LED2  (via drill 0.3)
  Top 0.203: 31.27,18.76 U2.20 31.25,19.27 31.55,19.56 32.59,19.56 34.31,21.29 34.31,23.19 v34.42,23.29
  Bottom 0.203: v34.42,23.29 34.42,24.13 35.2,24.92 37.11,24.92 37.54,24.49 37.54,21.67 37.82,21.39 PWR.2
N$1
  Bottom 0.203: U1.1 28.21,15.61 28.96,16.36 C6.1
N$2
  Bottom 0.203: U1.6 28.23,12.36 29.05,11.54 C8.2
N$3
  Top 0.61: C10.1 arc-90 2.24,30.5 L2.2 6.87,31.81 arc-90 PRI.3
N$4
  Bottom 0.203: C6.2 32.48,16.36 32.87,15.98 32.87,14.96 32.08,14.17 28.37,14.17 28.23,14.31 U1.3
N$5
  Bottom 0.203: U1.2 C9.2
N$6
  Top 0.61: U$9.2 3.14,25.05 arc-90 1.55,26.64 1.55,28.19 arc90 C10.2
N$7
  Bottom 0.203: C7.1 28.37,12.93 28.29,13.01 U1.5
N$8
  Bottom 0.203: U1.4 28.29,13.66 28.45,13.82 30.79,13.82 31.2,13.4 C7.2
N$9
  Top 0.61: U$9.36 19.95,25.05 arc90 21.54,26.64 21.54,29.2 arc90 C11.1
N$10
  Top 0.203: U$9.26 20.89,12.35 R5.1
N$11
  Top 0.203: R3.2 31.73,10.94 J2.B5
N$12
  Top 0.203: R4.2 31.75,7.94 J2.A5
N$13  (via drill 0.3)
  Top 0.381: J2.VBUS2 34.36,11.64 34.69,11.31 35.09,11.31 35.43,10.97 35.43,7.39 35.11,7.07 34.69,7.07 34.36,6.74 J2.VBUS1
  Top 0.508: J2.VBUS1 32.29,6.74 v32.08,6.53
  Bottom 0.508: v32.08,6.53 32.08,4.72 34.7,2.1 D2.A
N$14
  Bottom 0.508: L1.2 9.92,17.13 11.14,18.36 IC1.2
N$15  (via drill 0.3)
  Top 0.203: U2.5 23.7,24.38 v21.89,24.38
  Bottom 0.203: v21.89,24.38 22.68,24.38 R2.1
N$16
  Top 0.203: U$9.25 20.9,11.08 R6.1
N$26
  Top 0.61: SEC.3 17.6,30.86 | 17.6,30.86 17.6,30.52 arc90 L3.2 | C11.2 17.7,30.76 arc-90 17.6,30.86
N$27
  Top 0.61: L2.1 9.88,30.5 arc90 C15.2
N$29
  Top 0.203: PVT.A R7.2
N$30
  Top 0.61: C16.2 L3.1
N$31
  Top 0.203: ERR.A R8.2
PPS  (via drill 0.3)
  Top 0.203: U$9.30 18.22,17.43 16.43,15.65 v16.43,10.46
  Bottom 0.203: v16.43,10.46 16.43,8.28 17.14,7.57 17.14,2.41 17.86,1.7 23.04,1.7 23.52,2.19 J1.8
PVT_STAT_LED
  Top 0.203: R8.1 23.79,11.06 24.54,10.31 24.54,6.35 23.78,5.59 7.77,5.59 6.07,7.29 U$9.15
RESET  (via drill 0.3)
  Top 0.203: C17.1 22.35,22.04 U2.8 v25.41,22.04 v25.42,22.05
  Bottom 0.203: RESET.B' v25.42,22.05 RESET.B 27.09,27.17 R9.1
ROUT1  (via drill 0.3)
  Top 0.203: v32.03,17.98 32.03,18.72 U2.21 | U$9.17 8.61,6.78 9.45,5.94 22.53,5.94 v23.11,6.53
  Bottom 0.203: v32.03,17.98 32,17.96 24.31,17.96 22.76,16.41 22.76,13.18 22.59,13.01 U1.12 20.3,13.01 18.39,11.1 18.39,5.99 19.1,5.28 21.87,5.28 v23.11,6.53
ROUT2  (via drill 0.3)
  Top 0.203: v20.34,7.21 20.34,7.11 19.89,6.66 11.63,6.66 11.15,7.14 U$9.19
  Bottom 0.203: U1.9 20.71,11.06 20.34,10.69 v20.34,7.21
RST
  Top 0.203: U2.6 21.81,23.64 20.9,22.73 20.9,21.72 20.43,21.24 U$9.33
RTK_STAT  (via drill 0.3)
  Top 0.203: v7.32,7.34 7.32,8.97 U$9.16
  Bottom 0.203: RTK.2 6.72,6.75 v7.32,7.34
RXD  (via drill 0.3)
  Top 0.203: U2.30 v36.32,23.65 | v22.48,18.14 21.64,18.14 20.83,17.32 20.83,14.3 20.15,13.62 U$9.27
  Bottom 0.203: v36.32,23.65 35.92,23.65 35.48,23.22 35.48,19.76 34.31,18.59 22.94,18.59 v22.48,18.14
S1_RX  (via drill 0.3)
  Top 0.203: v27.23,8.28 27.23,7.21 24.49,4.47 11.18,4.47 10.82,4.12 J1.3
  Bottom 0.203: U1.8 v27.23,8.28
S1_TX  (via drill 0.3)
  Top 0.203: J1.1 5.74,4.14 6.43,4.83 24.15,4.83 25.83,6.51 v25.83,7.9
  Bottom 0.203: v25.83,7.9 25.83,11.33 26.21,11.71 U1.7
S2_RX
  Bottom 0.203: U1.13 19.63,13.66 18.67,12.7 18.67,11.96 17.25,10.54 17.25,8.51 17.68,8.08 17.68,4.75 18.44,3.98 J1.6
S2_TX
  Bottom 0.203: U1.14 18.81,14.31 18.16,13.66 18.16,12.17 17.25,11.25 14.25,11.25 13.36,10.37 J1.4
TXD  (via drill 0.3)
  Top 0.203: U2.31 36.7,24.44 v36.93,24.21 | v22.48,19 21.77,19 20.4,17.63 20.4,15.19 20.1,14.89 U$9.28
  Bottom 0.203: v36.93,24.21 35.81,24.21 35.05,23.44 35.05,19.96 34.09,19 v22.48,19
VIN  (via drill 0.3)
  Top 0.508: J1.10 28.6,1.71 28.02,1.12 4.67,1.12 3.23,2.56 v3.23,7.67
  Bottom 0.508: C3.2 C4.2 C5.2 13.44,14.75 | IC1.1 12.98,15.21 13.44,14.75 | J1.10 30.66,3.17 31.16,2.67 D2.C | v3.23,7.67 4.06,8.51 11,8.51 12.01,9.53 12.01,13.72 13.05,14.75 13.44,14.75

### Text on the board
tPlace: + | G | + | G | G | + | S1TX | G | S1RX | S2TX | G | S2RX | G | PPS | G | VIN